# Altium schematic sheet Sheet1.SchDoc
size A4; SheetNumber: 2; SheetTotal: 2
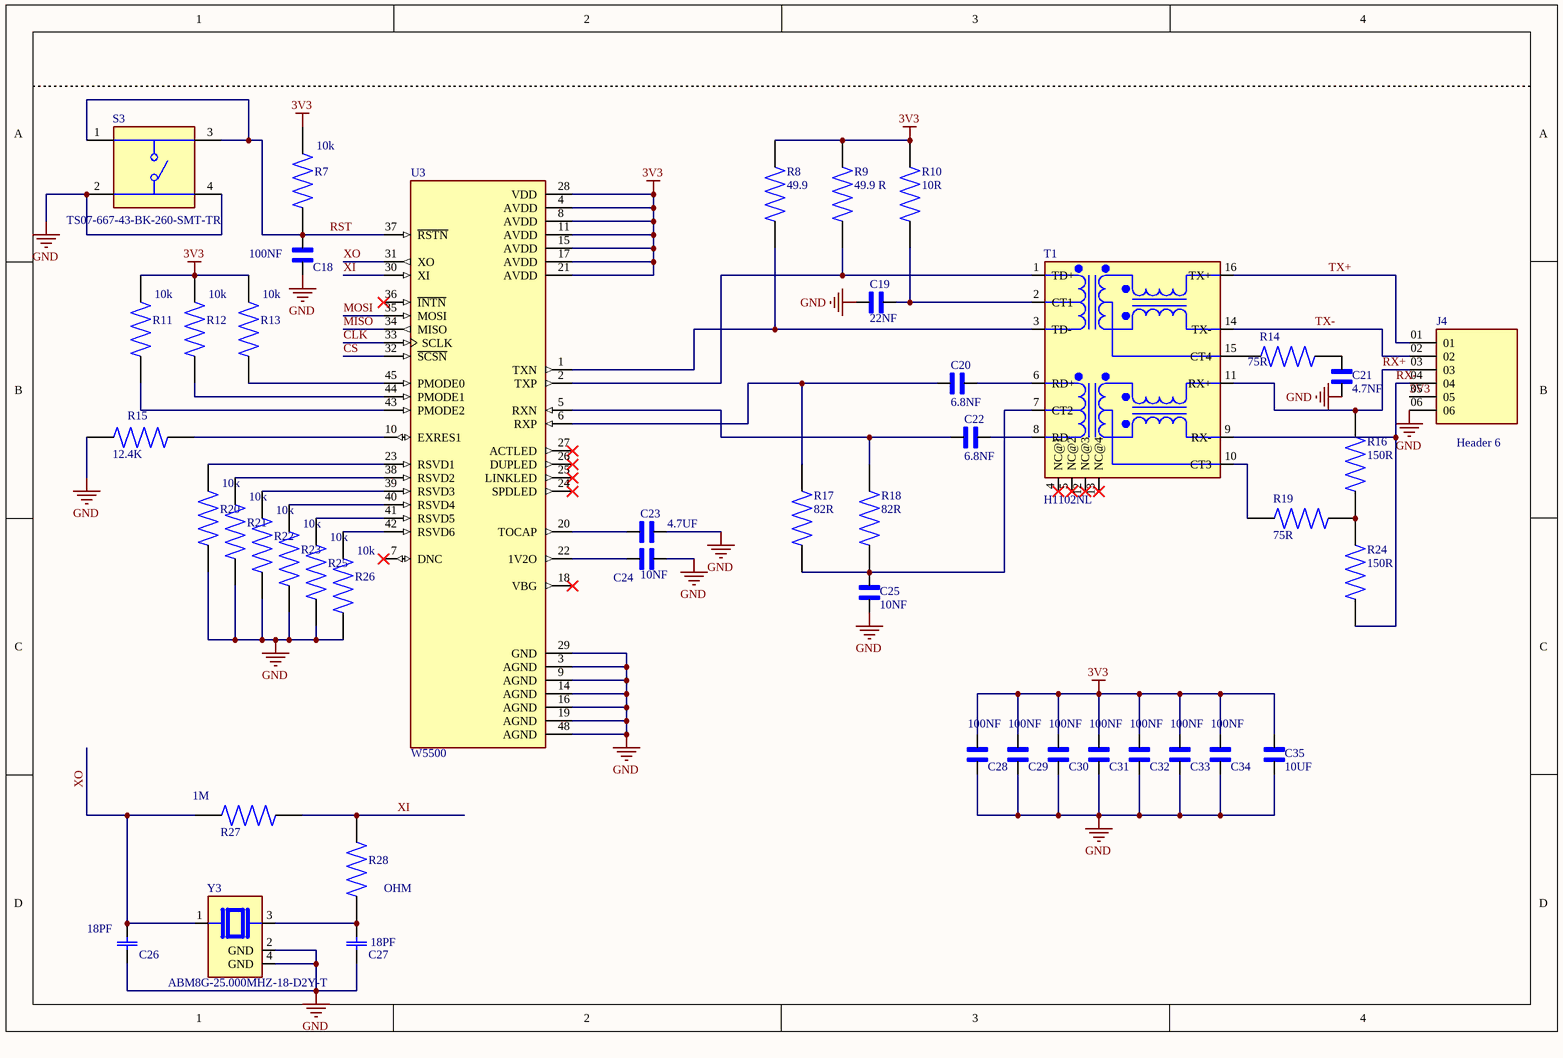
[diagram p0: Sheet1.SchDoc]

## Parts
C18  100NF  [CAPC1608X90]
C19  22NF  [CAPC1608X90]
C20  6.8NF  [CAPC1608X90]
C21  4.7NF  [CAPC1608X90]
C22  6.8NF  [CAPC1608X90]
C23  4.7UF  [CAPC2012X135N]
C24  10NF  [CAPC1608X90]
C25  10NF  [CAPC1608X90]
C26  18PF  [CAPC1608X85N]
C27  18PF  [CAPC1608X85N]
C28  100NF  [CAPC1608X90]
C29  100NF  [CAPC1608X90]
C30  100NF  [CAPC1608X90]
C31  100NF  [CAPC1608X90]
C32  100NF  [CAPC1608X90]
C33  100NF  [CAPC1608X90]
C34  100NF  [CAPC1608X90]
C35  10UF  [CAPC2012X135N]
J4  Header 6  [SAMTEC_MTLW-106-06-G-S-180]
R7  10k  [RESC3116X65N]
R8  49.9  [RESC3116X65N]
R9  49.9 R  [RESC3116X65N]
R10  10R  [RESC3116X65N]
R11  10k  [RESC3116X65N]
R12  10k  [RESC3116X65N]
R13  10k  [RESC3116X65N]
R14  75R  [RESC3116X65N]
R15  12.4K  [RESC3116X65N]
R16  150R  [RESC3116X65N]
R17  82R  [RESC3116X65N]
R18  82R  [RESC3116X65N]
R19  75R  [RESC3116X65N]
R20  10k  [RESC3116X65N]
R21  10k  [RESC3116X65N]
R22  10k  [RESC3116X65N]
R23  10k  [RESC3116X65N]
R24  150R  [RESC3116X65N]
R25  10k  [RESC3116X65N]
R26  10k  [RESC3116X65N]
R27  1M  [RESC3116X65N]
R28  OHM  [RESC3116X65N]
S3  TS07-667-43-BK-260-SMT-TR  [SW_TS07-667-43-BK-260-SMT-TR]
T1  H1102NL  [H1102NL]
U3  W5500  [QFP50P900X900X160-48N]
Y3  ABM8G-25.000MHZ-18-D2Y-T  [XTAL_ABM8G-25.000MHZ-18-D2Y-T]

## Nets
3V3: C28.2 C29.2 C30.2 C31.2 C32.2 C33.2 C34.2 C35.1 J4.05 R7.2 R8.1 R9.1 R10.1 R11.2 R12.2 R13.2 U3.4(AVDD) U3.8(AVDD) U3.11(AVDD) U3.15(AVDD) U3.17(AVDD) U3.21(AVDD) U3.28(VDD)
GND: C18.1 C19.2 C21.2 C23.2 C24.1 C25.2 C26.1(C1) C27.1(C1) C28.1 C29.1 C30.1 C31.1 C32.1 C33.1 C34.1 C35.2 J4.06 R15.2 R20.1 R21.1 R22.1 R23.1 R25.1 R26.1 S3.2 S3.4 U3.3(AGND) U3.9(AGND) U3.14(AGND) U3.16(AGND) U3.19(AGND) U3.29(GND) U3.48(AGND) Y3.2(GND) Y3.4(GND)
CLK: U3.33(SCLK)
CS: U3.32(~{SCSN})
MISO: U3.34(MISO)
MOSI: U3.35(MOSI)
RST: C18.2 R7.1 S3.1 S3.3 U3.37(~{RSTN})
RX+: J4.03 R16.1 T1.11(RX+)
RX-: J4.04 R24.2 T1.9(RX-)
TX+: J4.01 T1.16(TX+)
TX-: J4.02 T1.14(TX-)
XI: R27.1 R28.2 U3.30(XI)
XO: C26.2(C2) R27.2 U3.31(XO) Y3.1
NetC19_1: C19.1 R10.2 T1.2(CT1)
NetC20_1: C20.1 T1.6(RD+)
NetC20_2: C20.2 R17.1 U3.6(RXP)
NetC21_1: C21.1 R14.2
NetC22_1: C22.1 T1.8(RD-)
NetC22_2: C22.2 R18.1 U3.5(RXN)
NetC23_1: C23.1 U3.20(TOCAP)
NetC24_2: C24.2 U3.22(1V2O)
NetC25_1: C25.1 R17.2 R18.2 T1.7(CT2)
NetC27_2: C27.2(C2) R28.1 Y3.3
NetR8_2: R8.2 T1.3(TD-) U3.1(TXN)
NetR9_2: R9.2 T1.1(TD+) U3.2(TXP)
NetR11_1: R11.1 U3.43(PMODE2)
NetR12_1: R12.1 U3.44(PMODE1)
NetR13_1: R13.1 U3.45(PMODE0)
NetR14_1: R14.1 T1.15(CT4)
NetR15_1: R15.1 U3.10(EXRES1)
NetR16_2: R16.2 R19.2 R24.1
NetR19_1: R19.1 T1.10(CT3)
NetR20_2: R20.2 U3.23(RSVD1)
NetR21_2: R21.2 U3.38(RSVD2)
NetR22_2: R22.2 U3.39(RSVD3)
NetR23_2: R23.2 U3.40(RSVD4)
NetR25_2: R25.2 U3.41(RSVD5)
NetR26_2: R26.2 U3.42(RSVD6)

Not connected (* = marked no-connect by the designer): T1 4(NC@1)* 5(NC@2)* 12(NC@3)* 13(NC@4)*; U3 7(DNC)* 18(VBG)* 24(SPDLED)* 25(LINKLED)* 26(DUPLED)* 27(ACTLED)* 36(~{INTN})*

## Library data of the parts
C18 C28-C34 = C0603C104J3RACTU: 0603 C 100nF Ceramic Multilayer Capacitor, 25 V, +125degC, X7R Dielectric, +/-5% | KEMET C0603C104J3RACTU; SnapEDA_Link: https://www.snapeda.com/parts/C0603C104J3RACTU/KEMET/view-part/?ref=snap; Package: 603-2 KEMET; Value: *; MF: KEMET; MP: C0603C104J3RACTU; Check_prices: https://www.snapeda.com/parts/C0603C104J3RACTU/KEMET/view-part/?ref=eda
C19 = C0603C104J3RACTU: 0603 C 22nF Ceramic Multilayer Capacitor, 25 V, +125degC, X7R Dielectric, +/-5% | KEMET C0603C104J3RACTU; SnapEDA_Link: https://www.snapeda.com/parts/C0603C104J3RACTU/KEMET/view-part/?ref=snap; Package: 603-2 KEMET; Value: *; MF: KEMET; MP: C0603C104J3RACTU; Check_prices: https://www.snapeda.com/parts/C0603C104J3RACTU/KEMET/view-part/?ref=eda
C20 C22 = C0603C104J3RACTU: 0603 C 6.8nF Ceramic Multilayer Capacitor, 25 V, +125degC, X7R Dielectric, +/-5% | KEMET C0603C104J3RACTU; SnapEDA_Link: https://www.snapeda.com/parts/C0603C104J3RACTU/KEMET/view-part/?ref=snap; Package: 603-2 KEMET; Value: *; MF: KEMET; MP: C0603C104J3RACTU; Check_prices: https://www.snapeda.com/parts/C0603C104J3RACTU/KEMET/view-part/?ref=eda
C21 = C0603C104J3RACTU: 0603 C 4.7 nF Ceramic Multilayer Capacitor, 25 V, +125degC, X7R Dielectric, +/-5% | KEMET C0603C104J3RACTU; SnapEDA_Link: https://www.snapeda.com/parts/C0603C104J3RACTU/KEMET/view-part/?ref=snap; Package: 603-2 KEMET; Value: *; MF: KEMET; MP: C0603C104J3RACTU; Check_prices: https://www.snapeda.com/parts/C0603C104J3RACTU/KEMET/view-part/?ref=eda
C23 = CL21B225KPFNNNG: 4.7µF Â±10% 10V Ceramic Capacitor X7R 0805 (2012 Metric); MF: Samsung; SnapEDA_Link: https://www.snapeda.com/parts/CL21B225KPFNNNG/Samsung/view-part/?ref=snap; Package: SMD-2 Samsung; Value: *; MP: CL21B225KPFNNNG; Check_prices: https://www.snapeda.com/parts/CL21B225KPFNNNG/Samsung/view-part/?ref=eda
C24 C25 = C0603C104J3RACTU: 0603 C 10nF Ceramic Multilayer Capacitor, 25 V, +125degC, X7R Dielectric, +/-5% | KEMET C0603C104J3RACTU; SnapEDA_Link: https://www.snapeda.com/parts/C0603C104J3RACTU/KEMET/view-part/?ref=snap; Package: 603-2 KEMET; Value: *; MF: KEMET; MP: C0603C104J3RACTU; Check_prices: https://www.snapeda.com/parts/C0603C104J3RACTU/KEMET/view-part/?ref=eda
C26 C27 = C0603C200J5GACTU: 18 pF ±5% 50V Ceramic Capacitor C0G, NP0 0603 (1608 Metric); MF: KEMET; SnapEDA_Link: https://www.snapeda.com/parts/C0603C200J5GACTU/KEMET/view-part/?ref=snap; Package: 0603 Kemet; Value: *; MP: C0603C200J5GACTU; Check_prices: https://www.snapeda.com/parts/C0603C200J5GACTU/KEMET/view-part/?ref=eda
C35 = CL21B225KPFNNNG: 10 µF Â±10% 10V Ceramic Capacitor X7R 0805 (2012 Metric); MF: Samsung; SnapEDA_Link: https://www.snapeda.com/parts/CL21B225KPFNNNG/Samsung/view-part/?ref=snap; Package: SMD-2 Samsung; Value: *; MP: CL21B225KPFNNNG; Check_prices: https://www.snapeda.com/parts/CL21B225KPFNNNG/Samsung/view-part/?ref=eda
J4 = MTLW-106-06-G-S-180: Package: None; MP: MTLW-106-06-G-S-180; Price: None; Availability: Unavailable; Value: *
R7 R11-R13 R20-R23 R25 R26 = AC1206FR-070RL: 10 kOhms ±1% 0.25W, 1/4W Chip Resistor 1206 (3216 Metric) Moisture Resistant Thick Film; MF: Yageo; SnapEDA_Link: https://www.snapeda.com/parts/AC1206FR-070RL/Yageo/view-part/?ref=snap; Package: SMD-2 Yageo; Value: *; MP: AC1206FR-070RL; Check_prices: https://www.snapeda.com/parts/AC1206FR-070RL/Yageo/view-part/?ref=eda
R8 R9 = AC1206FR-070RL: 49.9 Ohms ±1% 0.25W, 1/4W Chip Resistor 1206 (3216 Metric) Moisture Resistant Thick Film; MF: Yageo; SnapEDA_Link: https://www.snapeda.com/parts/AC1206FR-070RL/Yageo/view-part/?ref=snap; Package: SMD-2 Yageo; Value: *; MP: AC1206FR-070RL; Check_prices: https://www.snapeda.com/parts/AC1206FR-070RL/Yageo/view-part/?ref=eda
R10 = AC1206FR-070RL: 10 Ohms ±1% 0.25W, 1/4W Chip Resistor 1206 (3216 Metric) Moisture Resistant Thick Film; MF: Yageo; SnapEDA_Link: https://www.snapeda.com/parts/AC1206FR-070RL/Yageo/view-part/?ref=snap; Package: SMD-2 Yageo; Value: *; MP: AC1206FR-070RL; Check_prices: https://www.snapeda.com/parts/AC1206FR-070RL/Yageo/view-part/?ref=eda
R14 R19 = AC1206FR-070RL: 75 Ohms Jumper Chip Resistor 1206 (3216 Metric) Automotive AEC-Q200 Thick Film; MF: Yageo; SnapEDA_Link: https://www.snapeda.com/parts/AC1206FR-070RL/Yageo/view-part/?ref=snap; Package: SMD-2 Yageo; Value: *; MP: AC1206FR-070RL; Check_prices: https://www.snapeda.com/parts/AC1206FR-070RL/Yageo/view-part/?ref=eda
R15 = AC1206FR-070RL: 12.4 kOhms ±1% 0.25W, 1/4W Chip Resistor 1206 (3216 Metric) Moisture Resistant Thick Film; MF: Yageo; SnapEDA_Link: https://www.snapeda.com/parts/AC1206FR-070RL/Yageo/view-part/?ref=snap; Package: SMD-2 Yageo; Value: *; MP: AC1206FR-070RL; Check_prices: https://www.snapeda.com/parts/AC1206FR-070RL/Yageo/view-part/?ref=eda
R16 R24 = AC1206FR-070RL: 150 Ohms Jumper Chip Resistor 1206 (3216 Metric) Automotive AEC-Q200 Thick Film; MF: Yageo; SnapEDA_Link: https://www.snapeda.com/parts/AC1206FR-070RL/Yageo/view-part/?ref=snap; Package: SMD-2 Yageo; Value: *; MP: AC1206FR-070RL; Check_prices: https://www.snapeda.com/parts/AC1206FR-070RL/Yageo/view-part/?ref=eda
R17 R18 = AC1206FR-070RL: 82 Ohms ±1% 0.25W, 1/4W Chip Resistor 1206 (3216 Metric) Moisture Resistant Thick Film; MF: Yageo; SnapEDA_Link: https://www.snapeda.com/parts/AC1206FR-070RL/Yageo/view-part/?ref=snap; Package: SMD-2 Yageo; Value: *; MP: AC1206FR-070RL; Check_prices: https://www.snapeda.com/parts/AC1206FR-070RL/Yageo/view-part/?ref=eda
R27 = AC1206FR-070RL: 1 MOhms ±1% 0.25W, 1/4W Chip Resistor 1206 (3216 Metric) Moisture Resistant Thick Film; MF: Yageo; SnapEDA_Link: https://www.snapeda.com/parts/AC1206FR-070RL/Yageo/view-part/?ref=snap; Package: SMD-2 Yageo; Value: *; MP: AC1206FR-070RL; Check_prices: https://www.snapeda.com/parts/AC1206FR-070RL/Yageo/view-part/?ref=eda
R28 = AC1206FR-070RL: 0 Ohms Jumper Chip Resistor 1206 (3216 Metric) Automotive AEC-Q200 Thick Film; MF: Yageo; SnapEDA_Link: https://www.snapeda.com/parts/AC1206FR-070RL/Yageo/view-part/?ref=snap; Package: SMD-2 Yageo; Value: *; MP: AC1206FR-070RL; Check_prices: https://www.snapeda.com/parts/AC1206FR-070RL/Yageo/view-part/?ref=eda
S3 = TS07-667-43-BK-260-SMT-TR: 6 x 6.7 mm, 4.3 mm Actuator Height, 260 gf, Black, Surface Mount, SPST, Tactile Switch; MF: Same Sky; SnapEDA_Link: https://www.snapeda.com/parts/TS07-667-43-BK-260-SMT-TR/Same+Sky/view-part/?ref=snap; Package: None; Value: *; MP: TS07-667-43-BK-260-SMT-TR; Check_prices: https://www.snapeda.com/parts/TS07-667-43-BK-260-SMT-TR/Same+Sky/view-part/?ref=eda
T1 = H1102NL: - Isolation and Data Interface (Encapsulated) Pulse Transformer 1:1 Transmitter, 1:1 Receiver Surface Mount; SnapEDA_Link: https://www.snapeda.com/parts/H1102NL/Pulse/view-part/?ref=snap; Package: Non Standard Pulse; Value: *; MF: Pulse; MP: H1102NL; Check_prices: https://www.snapeda.com/parts/H1102NL/Pulse/view-part/?ref=eda
U3 = W5500: Hardwired TCP/IP embedded Ethernet controller; Availability: Unavailable; MP: W5500; Value: *; Price: None; Package: None
Y3 = ABM8G-25.000MHZ-18-D2Y-T: 25 MHz Â±20ppm Crystal 18pF 60 Ohms 4-SMD, No Lead; MF: Abracon; Value: *; SnapEDA_Link: https://www.snapeda.com/parts/ABM8G-25.000MHZ-18-D2Y-T/Abracon+LLC/view-part/?ref=snap; Purchase-URL: https://pricing.snapeda.com/search/part/ABM8G-25.000MHZ-18-D2Y-T/?ref=eda; Availability: In Stock; Price: None; Package: SMD-4 Abracon; Check_prices: https://www.snapeda.com/parts/ABM8G-25.000MHZ-18-D2Y-T/Abracon+LLC/view-part/?ref=eda; MP: ABM8G-25.000MHZ-18-D2Y-T